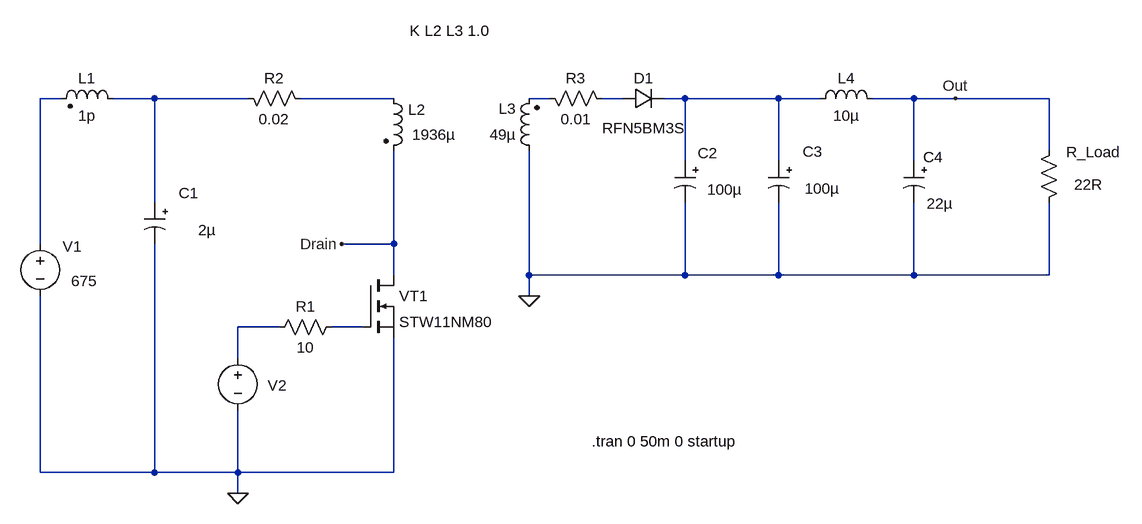
[diagram p0: schematic Flyback_675V_to_15V.asc]
Flyback_675V_to_15V.asc, the LTspice schematic file:
Version 4
SHEET 1 10096 680
WIRE 7808 -6208 7776 -6208
WIRE 7952 -6208 7888 -6208
WIRE 8096 -6208 7952 -6208
WIRE 8320 -6208 8176 -6208
WIRE 8560 -6208 8528 -6208
WIRE 8672 -6208 8640 -6208
WIRE 8768 -6208 8736 -6208
WIRE 8912 -6208 8768 -6208
WIRE 8976 -6208 8912 -6208
WIRE 9120 -6208 9056 -6208
WIRE 9184 -6208 9120 -6208
WIRE 9328 -6208 9184 -6208
WIRE 9328 -6128 9328 -6208
WIRE 8768 -6112 8768 -6208
WIRE 8912 -6112 8912 -6208
WIRE 9120 -6112 9120 -6208
WIRE 7952 -6048 7952 -6208
WIRE 7776 -5984 7776 -6208
WIRE 8320 -5984 8320 -6128
WIRE 8320 -5984 8240 -5984
WIRE 8320 -5936 8320 -5984
WIRE 8528 -5936 8528 -6128
WIRE 8768 -5936 8768 -6048
WIRE 8768 -5936 8528 -5936
WIRE 8912 -5936 8912 -6048
WIRE 8912 -5936 8768 -5936
WIRE 9120 -5936 9120 -6048
WIRE 9120 -5936 8912 -5936
WIRE 9328 -5936 9328 -6048
WIRE 9328 -5936 9120 -5936
WIRE 8528 -5904 8528 -5936
WIRE 8144 -5856 8080 -5856
WIRE 8272 -5856 8224 -5856
WIRE 8080 -5808 8080 -5856
WIRE 7776 -5632 7776 -5904
WIRE 7952 -5632 7952 -5984
WIRE 7952 -5632 7776 -5632
WIRE 8080 -5632 8080 -5728
WIRE 8080 -5632 7952 -5632
WIRE 8320 -5632 8320 -5840
WIRE 8320 -5632 8080 -5632
WIRE 8080 -5600 8080 -5632
FLAG 8080 -5600 0
FLAG 8528 -5904 0
FLAG 8240 -5984 Drain
FLAG 9184 -6208 Out
SYMBOL ind2 8544 -6112 R180
WINDOW 0 36 80 Left 2
WINDOW 3 36 40 Left 2
SYMATTR InstName L3
SYMATTR Value 49µ
SYMATTR Type ind
SYMBOL nmos 8272 -5936 R0
SYMATTR InstName VT1
SYMATTR Value STW11NM80
SYMBOL voltage 8080 -5824 R0
WINDOW 123 0 0 Left 2
WINDOW 39 0 0 Left 2
WINDOW 0 46 58 Left 2
WINDOW 3 -72 -339 Invisible 2
SYMATTR InstName V2
SYMATTR Value PULSE(0 15 0 10n 10n 886n 10.0u)
SYMBOL diode 8672 -6224 M90
WINDOW 0 0 32 VBottom 2
WINDOW 3 46 33 VTop 2
SYMATTR InstName D1
SYMATTR Value RFN5BM3S
SYMBOL polcap 9136 -6112 M0
WINDOW 3 -44 66 Left 2
WINDOW 0 -29 -6 Left 2
SYMATTR Value 22µ
SYMATTR InstName C4
SYMATTR Description Capacitor
SYMATTR Type cap
SYMBOL res 9344 -6144 M0
WINDOW 0 -95 19 Left 2
WINDOW 3 -67 69 Left 2
SYMATTR InstName R_Load
SYMATTR Value 22R
SYMBOL voltage 7776 -6000 M0
WINDOW 3 -88 73 Left 2
WINDOW 123 0 0 Left 2
WINDOW 0 -64 20 Left 2
SYMATTR Value 675
SYMATTR InstName V1
SYMATTR SpiceLine Rser=0
SYMBOL ind2 8304 -6224 R0
WINDOW 0 38 33 Left 2
WINDOW 3 44 72 Left 2
SYMATTR InstName L2
SYMATTR Value 1936µ
SYMATTR Type ind
SYMBOL ind 9072 -6192 M270
WINDOW 0 32 56 VTop 2
WINDOW 3 5 56 VBottom 2
SYMATTR InstName L4
SYMATTR Value 10µ
SYMATTR SpiceLine Rser=0.001
SYMBOL polcap 8784 -6112 M0
WINDOW 3 -72 44 Left 2
WINDOW 0 -34 -12 Left 2
SYMATTR Value 100µ
SYMATTR InstName C2
SYMATTR Description Capacitor
SYMATTR Type cap
SYMATTR SpiceLine V=35 Irms=740m Rser=0.05 Lser=0
SYMBOL res 8544 -6224 M90
WINDOW 0 0 56 VBottom 2
WINDOW 3 32 56 VTop 2
SYMATTR InstName R3
SYMATTR Value 0.01
SYMBOL polcap 8928 -6112 M0
WINDOW 3 -78 43 Left 2
WINDOW 0 -52 -14 Left 2
SYMATTR Value 100µ
SYMATTR InstName C3
SYMATTR Description Capacitor
SYMATTR Type cap
SYMATTR SpiceLine Rser=0.05 Lser=0
SYMBOL ind2 7904 -6192 M270
WINDOW 0 32 56 VTop 2
WINDOW 3 5 56 VBottom 2
SYMATTR InstName L1
SYMATTR Value 1p
SYMATTR Type ind
SYMBOL res 8240 -5872 R90
WINDOW 0 0 56 VBottom 2
WINDOW 3 32 56 VTop 2
SYMATTR InstName R1
SYMATTR Value 10
SYMBOL polcap 7968 -6048 M0
WINDOW 3 -78 43 Left 2
WINDOW 0 -52 -14 Left 2
SYMATTR Value 2µ
SYMATTR InstName C1
SYMATTR Description Capacitor
SYMATTR Type cap
SYMATTR SpiceLine Lser=0
SYMBOL res 8080 -6224 M90
WINDOW 0 0 56 VBottom 2
WINDOW 3 32 56 VTop 2
SYMATTR InstName R2
SYMATTR Value 0.02
TEXT 8344 -6312 Left 2 !K L2 L3 1.0
TEXT 8624 -5680 Left 2 !.tran 0 50m 0 startup

The netlist it stands for:
* Flyback_675V_to_15V.asc
L3 0 N004 49µ
M§VT1 Drain N008 0 0 STW11NM80
V2 N007 0 PULSE(0 15 0 10n 10n 886n 10.0u)
D1 N005 N006 RFN5BM3S
C4 Out 0 22µ
R_Load Out 0 22R
V1 N001 0 675 Rser=0
L2 N003 Drain 1936µ
L4 Out N006 10µ Rser=0.001
C2 N006 0 100µ V=35 Irms=740m Rser=0.05 Lser=0
R3 N004 N005 0.01
C3 N006 0 100µ Rser=0.05 Lser=0
L1 N002 N001 1p
R1 N008 N007 10
C1 N002 0 2µ Lser=0
R2 N002 N003 0.02
.model D D
.lib standard.dio
.model NMOS NMOS
.model PMOS PMOS
.lib standard.mos
K L2 L3 1.0
.tran 0 50m 0 startup
.backanno
.end